# EAGLE design ESK8builders.it_4P_21700_v1 (EAGLE 9.6.2)
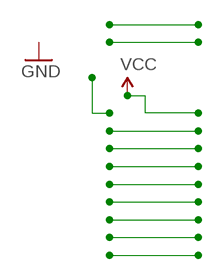
[diagram p0: schematic, sheet 1]

## Library data of the parts

## Board
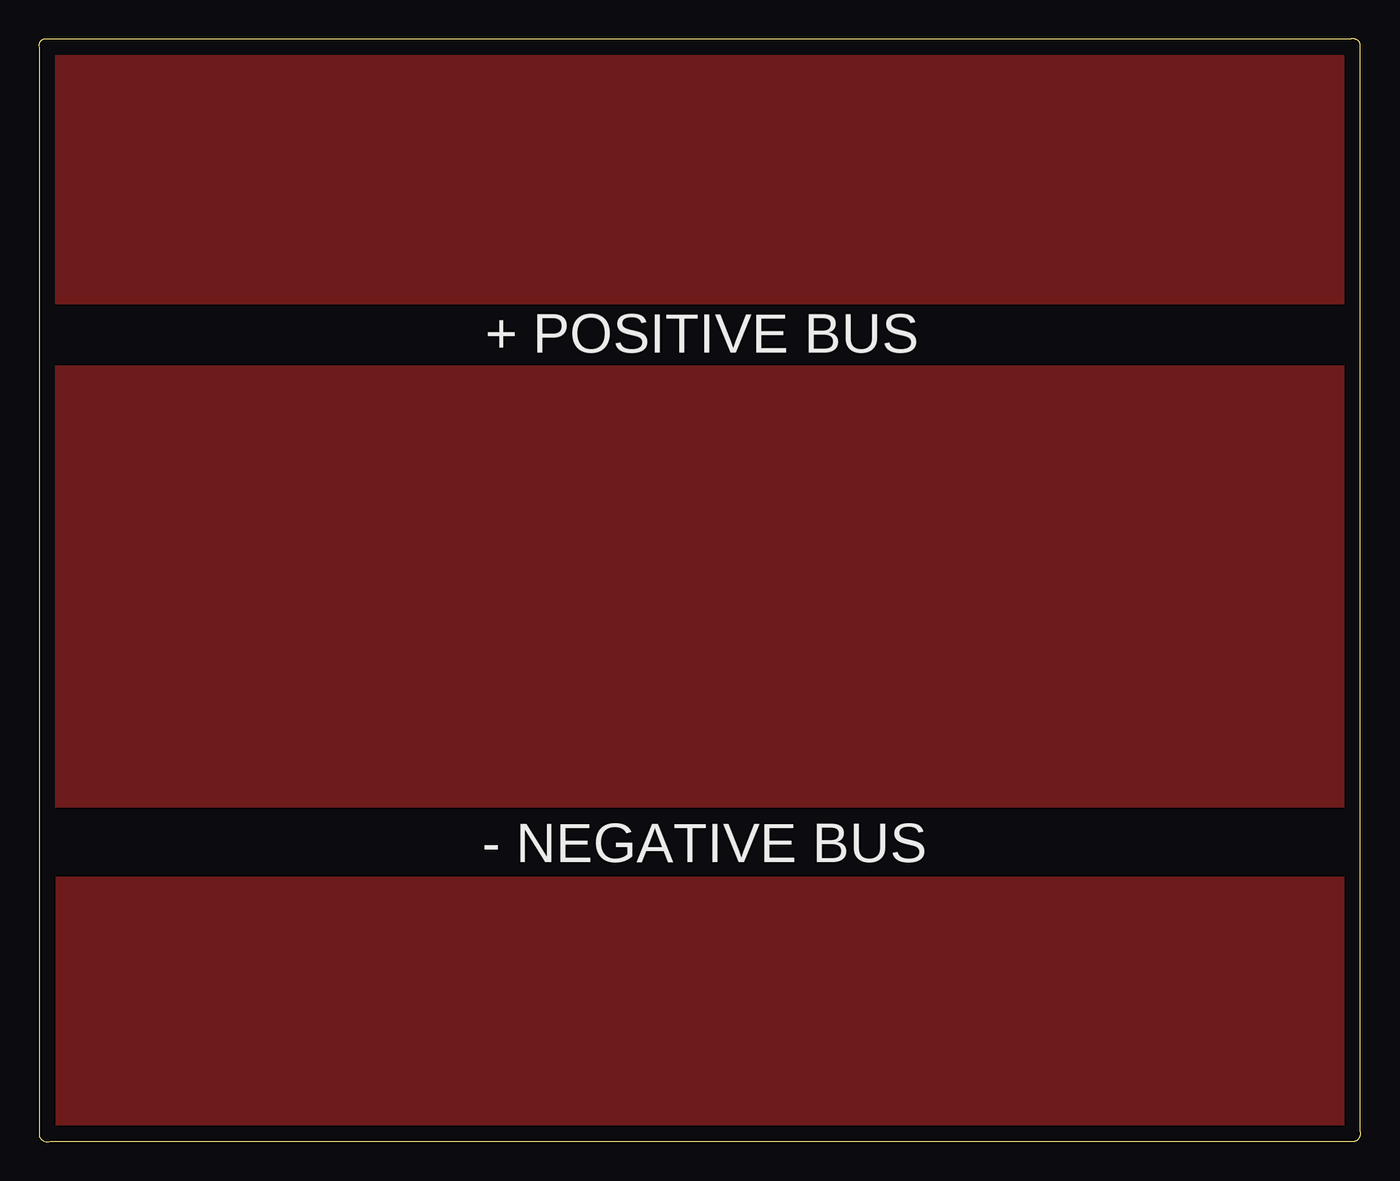
[diagram p1: board, top side]
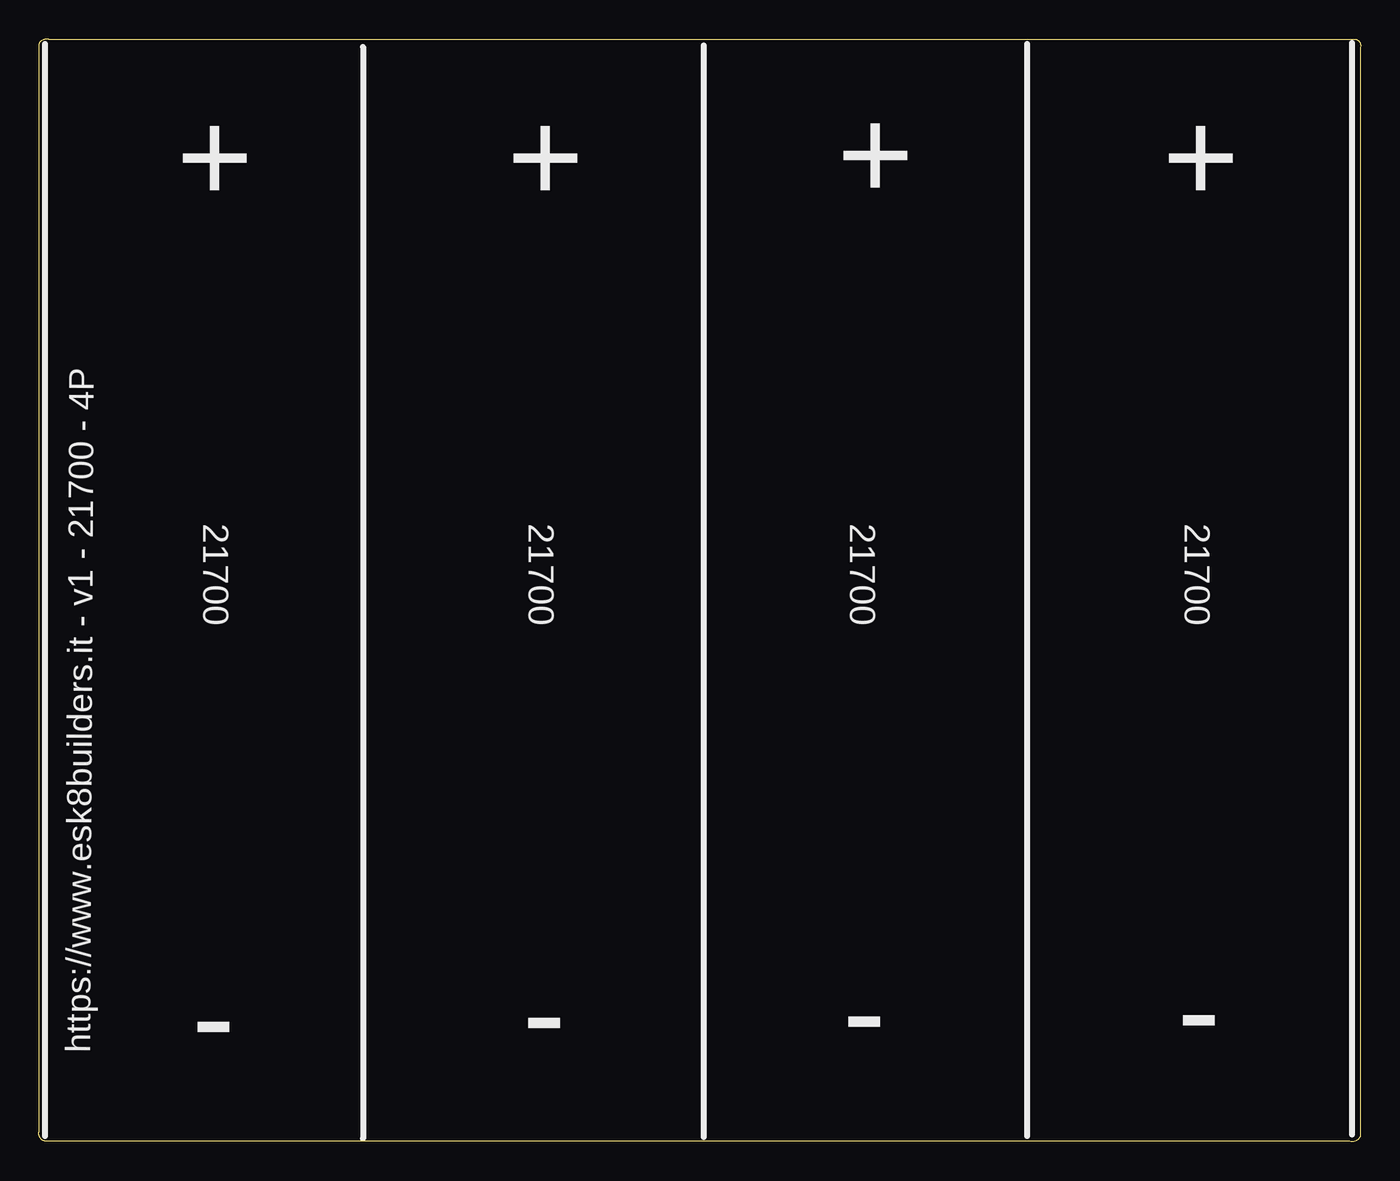
[diagram p2: board, bottom side, seen from below]

Size 85.11 x 71.02 mm. Coordinates in mm from the lower left corner, seen from the top.
Outline: 0.76,0.03 84.72,0.03 arc90 85.1,0.64 85.1,70.65 arc90 84.47,70.99 0.33,70.99 arc90 0.01,70.48 0.01,0.38 arc90 0.76,0.03
Copper layers (1*16): Top 0.035mm / dielectric 1.5mm / Bottom 0.035mm
Design rules "default": minimum track width 10mil, minimum drill 24mil, track to track 8mil, track to pad 8mil, pad to pad 8mil, via to via 8mil, smd to smd 8mil, copper to edge 40mil, drill to drill 8mil, minimum pad ring 10mil, minimum via ring 8mil, stop-mask expansion 4mil, vias tented up to drill 0mil, thermal gap 10mil

### Placement (x,y rotation side)
U$1  [ESK8BUILDERS.IT.RSTOP29]  11.23,15.16 0 top

### Tracks (layer width: path | path; a pad name or v marks a point on that pad's centre or on a via)
GND
  pour Top: 0.59,49.79 0.59,21.73 84.81,21.73 84.81,49.79
VCC
  pour Top: 0.67,70.49 84.72,70.49 84.72,54.13 0.67,54.13
VCC1
  pour Top: 0.84,16.86 84.72,16.86 84.72,0.41 0.84,0.41

### Text on the board
bPlace: + | + | + | + | - | - | - | - | https://www.esk8builders.it - v1 - 21700 - 4P
tNames: + POSITIVE BUS | - NEGATIVE BUS
bNames: 21700 | 21700 | 21700 | 21700